# Altium schematic sheet uc1C.SchDoc: Microcontroller 1 (Part C)
size A4; Author: Marcel Hellwig; Organization: Hamburg Bit-Bots; Address1: Vogt-Kölln-Str. 30; Address2: 22527 Hamburg; Address3: Germany; Address4: www.bit-bots.de; DocumentNumber: 5; Revision: A; SheetNumber: 5; SheetTotal: 16; EMail: info@bit-bots.de
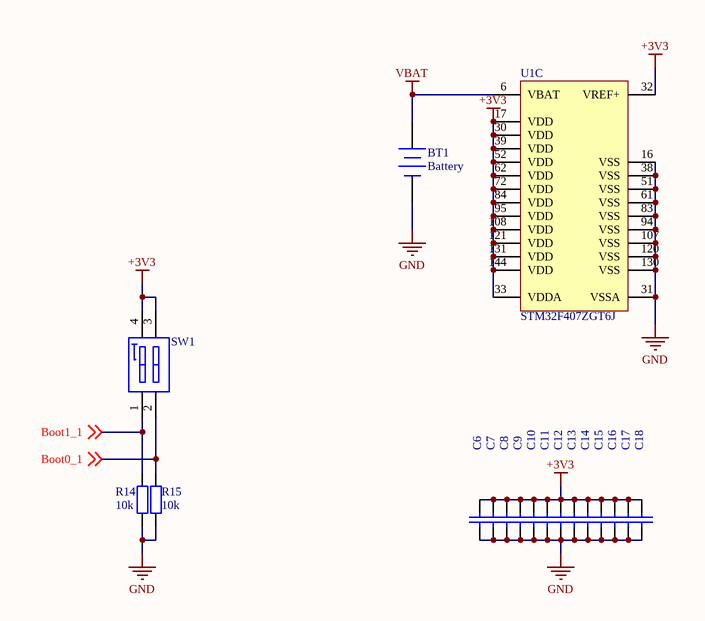
[diagram p0: uc1C.SchDoc]

## Parts
BT1  Battery  [2032 SMD Holder]
C6  100nF  [C2012]  (value not drawn)
C7  100nF  [C2012]  (value not drawn)
C8  100nF  [C2012]  (value not drawn)
C9  100nF  [C2012]  (value not drawn)
C10  100nF  [C2012]  (value not drawn)
C11  100nF  [C2012]  (value not drawn)
C12  100nF  [C2012]  (value not drawn)
C13  100nF  [C2012]  (value not drawn)
C14  100nF  [C2012]  (value not drawn)
C15  100nF  [C2012]  (value not drawn)
C16  100nF  [C2012]  (value not drawn)
C17  100nF  [C2012]  (value not drawn)
C18  100nF  [C2012]  (value not drawn)
R14  10k  [R2012]
R15  10k  [R2012]
SW1  418121270802  [418121270802]  (value not drawn)
U1  STM32F407ZGT6J  [STM-LQFP144_M]  (part C of 3)

## Nets
+3V3: C6.2 C7.2 C8.2 C9.2 C10.2 C11.2 C12.2 C13.2 C14.2 C15.2 C16.2 C17.2 C18.2 SW1.3 SW1.4 U1.17(VDD) U1.30(VDD) U1.32(VREF+) U1.33(VDDA) U1.39(VDD) U1.52(VDD) U1.62(VDD) U1.72(VDD) U1.84(VDD) U1.95(VDD) U1.108(VDD) U1.121(VDD) U1.131(VDD) U1.144(VDD)
GND: BT1.2(-) C6.1 C7.1 C8.1 C9.1 C10.1 C11.1 C12.1 C13.1 C14.1 C15.1 C16.1 C17.1 C18.1 R14.2 R15.1 U1.16(VSS) U1.31(VSSA) U1.38(VSS) U1.51(VSS) U1.61(VSS) U1.83(VSS) U1.94(VSS) U1.107(VSS) U1.120(VSS) U1.130(VSS)
VBAT: BT1.1(+) U1.6(VBAT)
Boot0_1: R15.2 SW1.2 ; off-sheet Boot0_1
Boot1_1: R14.1 SW1.1 ; off-sheet Boot1_1

## Notes on the sheet
- Project:
- Author:
- Title:
- Rev:
- Date:
- Time:
- Sheet
- of

## Library data of the parts
BT1 = Battery: Multicell Battery; Manufacturer: MULTICOMP; Manufacturer Part Number: CH28-2032LF; Published: 24-Mar-1999; LatestRevisionDate: 17-Jul-2002; LatestRevisionNote: Re-released for DXP Platform.; PackageReference: BAT-2; Publisher: Altium Limited; PackageDescription: Battery; 2 Leads; Supplier 1: Farnell; Supplier Part Number 1: 2064725; RoHS: YES; Stock 1: 10755; Pricing 1: 5=0,458, 25=0,415, 100=0,373, 250=0,303 (EUR); ComponentLink1URL: http://www.farnell.com/datasheets/1505865.pdf; ComponentLink1Description: http://www.farnell.com/datasheets/1505865.pdf
C6-C18 = Cap: Capacitor; Manufacturer: MULTICOMP; Manufacturer Part Number: MC0805B104K500CT; Produktpalette: Baureihe MC; Kapazität: 0.1; Kapazitätstoleranz: ±10%; Dielektrikum: X7; Nennspannung: 50; Keramikkondensatorgehäuse: 0805 [Metrisch 2012]; Betriebstemperatur, min.: -55; Betriebstemperatur, max.: 125; Verpackung: Gurtabschnitt; SVHC: No SVHC (17-Dec-2014); Betriebstemperatur: -55°C bis +125; Kondensatoranschlüsse: SMD<!--FANDB--><div class="features-and-benefits-container"></div>; Published: 8-Jun-2000; LatestRevisionDate: 17-Jul-2002; LatestRevisionNote: Re-released for DXP Platform.; PackageReference: RAD-0.3; Publisher: Altium Limited; PackageDescription: Radial Cap, Thru-Hole; 2 Leads; 0.3 in Pin Spacing; Value: 100nF; Supplier 1: Farnell; Supplier Part Number 1: 1759265; RoHS: YES; Stock 1: 692587; Pricing 1: 10=0,013, 100=0,011, 500=0,009, 1000=0,008, 2000=0,006 (EUR); MSL: -; Bauform: 0805 [Metrisch 2012]; Kapazitätstoleranz ±: ±10%; ComponentLink1URL: http://www.farnell.com/datasheets/1870456.pdf; ComponentLink1Description: http://www.farnell.com/datasheets/1870456.pdf
R14 R15 = Res2: Resistor; Manufacturer: MULTICOMP; Manufacturer Part Number: MC01W0805110K; Published: 8-Jun-2000; LatestRevisionDate: 17-Jul-2002; LatestRevisionNote: Re-released for DXP Platform.; PackageReference: AXIAL-0.4; Publisher: Altium Limited; PackageDescription: Axial Device, Thru-Hole; 2 Leads; 0.4 in Pin Spacing; Value: 10k; Supplier 1: Farnell; Supplier Part Number 1: 9332391; RoHS: Y-EX; Stock 1: 4370; Pricing 1: 50=0,038, 250=0,031, 1000=0,022, 5000=0,014, 15000=0,009 (EUR); ComponentLink1URL: http://www.farnell.com/datasheets/1729047.pdf; ComponentLink1Description: http://www.farnell.com/datasheets/1729047.pdf; ComponentLink2URL: http://www.farnell.com/cad/1561156.zip; ComponentLink2Description: http://www.farnell.com/cad/1561156.zip
SW1 = CMP-1438-00002-1: WS-DISV 2.54 mm small compact SMD Dip Switch with raised actuator; Manufacturer: Wuerth Elektronik; Manufacturer Part Number: A6S2104H; NoPins: 04; ComponentLink2URL: http://katalog.we-online.de/em/datasheet/4181212708xx.pdf; ComponentLink2Description: Datasheet; PackageReference: 418121270802; ComponentLink1Description: Manufacturer URL; PartNumber: 418121270802; ComponentLink1URL: http://www.we-online.com; Supplier 1: Farnell; Supplier Part Number 1: 1960894; RoHS: YES; Pricing 1: 1=1,79, 10=1,49, 25=1,23, 50=1,01, 100=0,921, 200=0,821, 500=0,651, 2000=0,625 (EUR); ComponentLink3URL: http://www.farnell.com/datasheets/1763372.pdf; ComponentLink3Description: http://www.farnell.com/datasheets/1763372.pdf
U1 = CMP-0243-00063-2: ARM Cortex-M4 32-bit MCU+FPU, 210 DMIPS, 1024 kB Flash, 192 kB Internal RAM, 114 I/Os, 144-pin LQFP, -40 to 85 degC, Tray; Manufacturer: STMicroelectronics; I/Os (High Current): 114; D/A Converter: 2x12-bit; Internal RAM Size (kB): 192; Operating Frequency(F) (Processor speed) (MHz): 168; Supply Voltage(Vcc) max (V): 3.6; Supply Voltage(Vcc) min (V): 1.8; FLASH Size (Prog) (kB): 1024; ComponentLink3Description: Package Specification; PackageVersion: Rev. 4, 06/2013; PartNumber: STM32F407ZGT6J; ComponentLink3URL: http://www.st.com/st-web-ui/static/active/en/resource/technical/document/datasheet/DM00037051.pdf; PackageReference: LQFP144; ComponentLink2URL: http://www.st.com/st-web-ui/static/active/en/resource/technical/document/datasheet/DM00037051.pdf; ComponentLink2Description: Datasheet; ComponentLink1Description: Manufacturer URL; Mounting Technology: Surface Mount; Core: ARM Cortex-M4; PackageDescription: 144-Pin Low Profile Quad Flat Package, 20 x 20 mm Body, 0.5 mm Pitch; Packing: Tray; ComponentLink1URL: http://www.st.com/web/en/home.html; DatasheetVersion: Rev. 4; PartId: 1; Supplier 1: Farnell; Supplier Part Number 1: 2333299